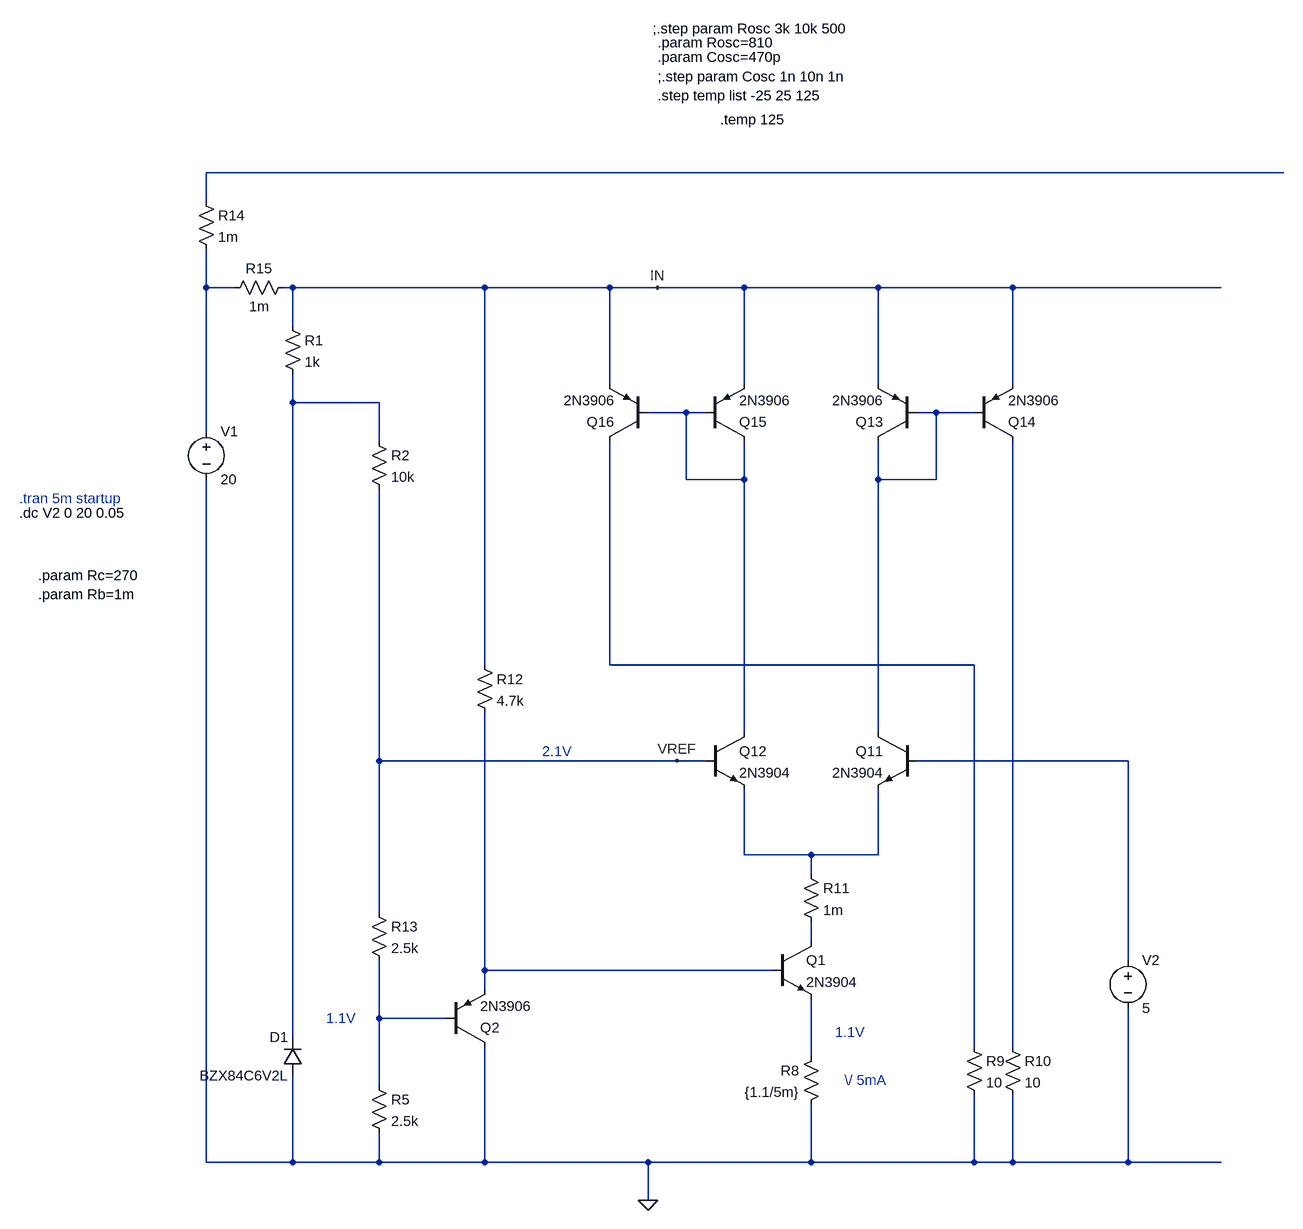
[diagram p0: schematic err_amp.asc]
err_amp.asc, the LTspice schematic file:
Version 4.1
SHEET 1 4228 3748
WIRE 3184 1824 160 1824
WIRE 160 1872 160 1824
WIRE 160 2016 160 1952
WIRE 208 2016 160 2016
WIRE 304 2016 288 2016
WIRE 624 2016 304 2016
WIRE 832 2016 624 2016
WIRE 912 2016 832 2016
WIRE 1056 2016 912 2016
WIRE 1280 2016 1056 2016
WIRE 1504 2016 1280 2016
WIRE 2528 2016 1504 2016
WIRE 304 2080 304 2016
WIRE 832 2176 832 2016
WIRE 1056 2176 1056 2016
WIRE 1280 2176 1280 2016
WIRE 1504 2176 1504 2016
WIRE 304 2208 304 2160
WIRE 448 2208 304 2208
WIRE 960 2224 896 2224
WIRE 992 2224 960 2224
WIRE 1376 2224 1344 2224
WIRE 1440 2224 1376 2224
WIRE 160 2256 160 2016
WIRE 448 2272 448 2208
WIRE 960 2336 960 2224
WIRE 1056 2336 1056 2272
WIRE 1056 2336 960 2336
WIRE 1280 2336 1280 2272
WIRE 1376 2336 1376 2224
WIRE 1376 2336 1280 2336
WIRE 624 2720 624 2016
WIRE 832 2720 832 2272
WIRE 1440 2720 832 2720
WIRE 1056 2832 1056 2336
WIRE 1280 2832 1280 2336
WIRE 448 2880 448 2352
WIRE 944 2880 448 2880
WIRE 992 2880 944 2880
WIRE 1696 2880 1344 2880
WIRE 1056 3152 1056 2928
WIRE 1168 3152 1056 3152
WIRE 1280 3152 1280 2928
WIRE 1280 3152 1168 3152
WIRE 1168 3184 1168 3152
WIRE 448 3248 448 2880
WIRE 1168 3296 1168 3264
WIRE 1696 3328 1696 2880
WIRE 624 3344 624 2800
WIRE 1104 3344 624 3344
WIRE 624 3376 624 3344
WIRE 448 3424 448 3328
WIRE 560 3424 448 3424
WIRE 304 3456 304 2208
WIRE 1440 3472 1440 2720
WIRE 1504 3472 1504 2272
WIRE 1168 3488 1168 3392
WIRE 448 3536 448 3424
WIRE 160 3664 160 2336
WIRE 304 3664 304 3520
WIRE 304 3664 160 3664
WIRE 448 3664 448 3616
WIRE 448 3664 304 3664
WIRE 624 3664 624 3472
WIRE 624 3664 448 3664
WIRE 896 3664 624 3664
WIRE 1168 3664 1168 3568
WIRE 1168 3664 896 3664
WIRE 1440 3664 1440 3552
WIRE 1440 3664 1168 3664
WIRE 1504 3664 1504 3552
WIRE 1504 3664 1440 3664
WIRE 1696 3664 1696 3408
WIRE 1696 3664 1504 3664
WIRE 2528 3664 1696 3664
WIRE 896 3728 896 3664
FLAG 896 3728 0
FLAG 912 2016 IN
FLAG 944 2880 VREF
SYMBOL voltage 160 2240 R0
SYMATTR InstName V1
SYMATTR Value 20
SYMBOL res 1184 3472 M0
SYMATTR InstName R8
SYMATTR Value {1.1/5m}
SYMBOL npn 1344 2832 M0
SYMATTR InstName Q11
SYMATTR Value 2N3904
SYMBOL npn 992 2832 R0
SYMATTR InstName Q12
SYMATTR Value 2N3904
SYMBOL pnp 1344 2272 R180
SYMATTR InstName Q13
SYMATTR Value 2N3906
SYMBOL pnp 1440 2272 M180
SYMATTR InstName Q14
SYMATTR Value 2N3906
SYMBOL pnp 992 2272 M180
SYMATTR InstName Q15
SYMATTR Value 2N3906
SYMBOL pnp 896 2272 R180
SYMATTR InstName Q16
SYMATTR Value 2N3906
SYMBOL diode 320 3520 R180
WINDOW 0 24 64 Left 2
WINDOW 3 24 0 Left 2
SYMATTR InstName D1
SYMATTR Value BZX84C6V2L
SYMBOL res 288 2064 R0
SYMATTR InstName R1
SYMATTR Value 1k
SYMBOL res 432 2256 R0
SYMATTR InstName R2
SYMATTR Value 10k
SYMBOL res 432 3520 R0
SYMATTR InstName R5
SYMATTR Value 2.5k
SYMBOL voltage 1696 3312 R0
WINDOW 123 0 0 Left 0
WINDOW 39 0 0 Left 0
SYMATTR InstName V2
SYMATTR Value 5
SYMBOL res 144 1856 R0
SYMATTR InstName R14
SYMATTR Value 1m
SYMBOL res 192 2032 R270
WINDOW 0 32 56 VTop 2
WINDOW 3 0 56 VBottom 2
SYMATTR InstName R15
SYMATTR Value 1m
SYMBOL res 1424 3456 R0
SYMATTR InstName R9
SYMATTR Value 10
SYMBOL res 1488 3456 R0
SYMATTR InstName R10
SYMATTR Value 10
SYMBOL res 1152 3168 R0
SYMATTR InstName R11
SYMATTR Value 1m
SYMBOL npn 1104 3296 R0
SYMATTR InstName Q1
SYMATTR Value 2N3904
SYMBOL res 608 2704 R0
SYMATTR InstName R12
SYMATTR Value 4.7k
SYMBOL pnp 560 3472 M180
SYMATTR InstName Q2
SYMATTR Value 2N3906
SYMBOL res 432 3232 R0
SYMATTR InstName R13
SYMATTR Value 2.5k
TEXT -152 2368 Left 2 ;.tran 5m startup
TEXT -120 2496 Left 2 !.param Rc=270
TEXT -120 2528 Left 2 !.param Rb=1m
TEXT 912 1608 Left 2 !.param Rosc=810
TEXT 904 1584 Left 2 !;.step param Rosc 3k 10k 500
TEXT 912 1632 Left 2 !.param Cosc=470p
TEXT 912 1664 Left 2 !;.step param Cosc 1n 10n 1n
TEXT 912 1696 Left 2 !.step temp list -25 25 125
TEXT 1016 1736 Left 2 !.temp 125
TEXT -152 2392 Left 2 !.dc V2 0 20 0.05
TEXT 360 3424 Left 2 ;1.1V
TEXT 1208 3448 Left 2 ;1.1V
TEXT 1224 3528 Left 2 ;\\/ 5mA
TEXT 720 2864 Left 2 ;2.1V

The netlist it stands for:
* err_amp.asc
V1 N002 0 20
R8 N013 0 {1.1/5m}
Q11 N005 N007 N008 0 2N3904
Q12 N004 VREF N008 0 2N3904
Q13 N005 N005 IN 0 2N3906
Q14 N012 N005 IN 0 2N3906
Q15 N004 N004 IN 0 2N3906
Q16 N006 N004 IN 0 2N3906
D1 0 N003 BZX84C6V2L
R1 IN N003 1k
R2 N003 VREF 10k
R5 N011 0 2.5k
V2 N007 0 5
R14 N001 N002 1m
R15 N002 IN 1m
R9 N006 0 10
R10 N012 0 10
R11 N008 N009 1m
Q1 N009 N010 N013 0 2N3904
R12 IN N010 4.7k
Q2 0 N011 N010 0 2N3906
R13 VREF N011 2.5k
.model D D
.lib standard.dio
.model NPN NPN
.model PNP PNP
.lib standard.bjt
* .tran 5m startup
.param Rc=270
.param Rb=1m
.param Rosc=810
;.step param Rosc 3k 10k 500
.param Cosc=470p
;.step param Cosc 1n 10n 1n
.step temp list -25 25 125
.temp 125
.dc V2 0 20 0.05
* 1.1V
* 1.1V
* \/ 5mA
* 2.1V
.backanno
.end